# EAGLE design DB3AC_Fldigi_Baofeng_V02 (EAGLE 6.6.0)
Assembly variants: TRxA, RxA, TRxB, RxA, TRxA, RxB, TRxB, RxB
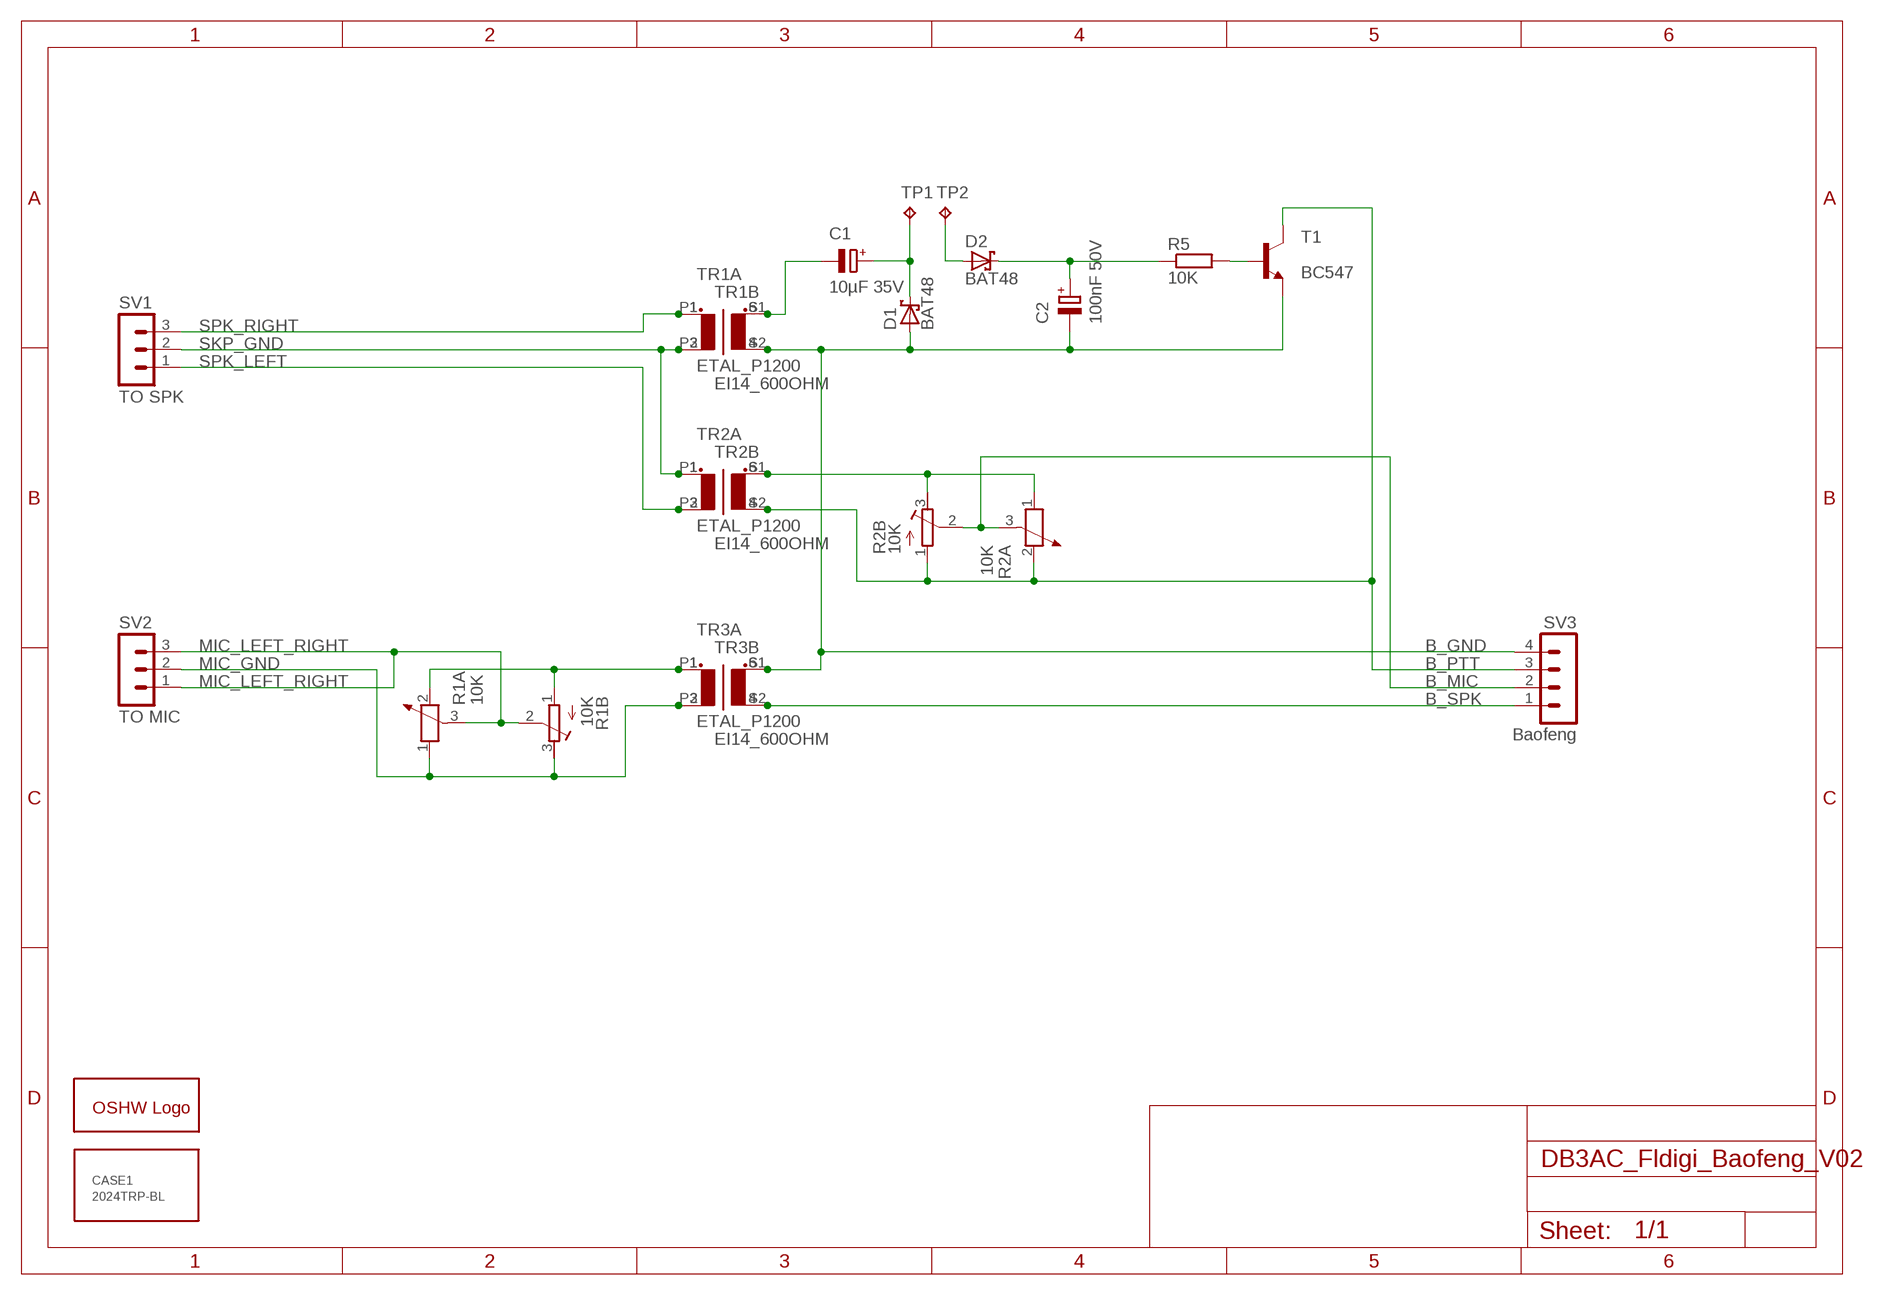
[diagram p0: schematic, sheet 1]

## Parts
C1  10µF 35V  CPOL-EUE2.5-7  [E2,5-7]
C2  100nF 50V  CPOL-EUE2.5-7  [E2,5-7]
CASE1  2024TRP-BL  [2024]
D1  BAT48  BAT42  [DO35-10]
D2  BAT48  BAT42  [DO35-10]
GOLD_ORB_SM1  OSHWLOGOLOGO8MM  [OSHW_8MM]
R1A  10K  POTENTIOMETER_PT-10  [PT-10]  (not fitted in variant TRxA, RxB)  (not fitted in variant TRxB, RxB)
R1B  10K  R-TRIMM3339P  [RTRIM3339P]  (not fitted in variant TRxA, RxA)  (not fitted in variant TRxB, RxA)
R2A  10K  POTENTIOMETER_PT-10  [PT-10]  (not fitted in variant TRxA, RxB)  (not fitted in variant TRxB, RxB)
R2B  10K  R-TRIMM3339P  [RTRIM3339P]  (not fitted in variant TRxA, RxA)  (not fitted in variant TRxB, RxA)
R5  10K  R-EU_0204/7  [0204/7]
SV1  TO SPK  MA03-1  [MA03-1]
SV2  TO MIC  MA03-1  [MA03-1]
SV3  Baofeng  MA04-1  [MA04-1]
T1  BC547  BC547-NPN-TO92-CBE  [TO92-CBE]
TP1  TPPAD1-13Y  [P1-13Y]
TP2  TPPAD1-13Y  [P1-13Y]
TR1A  ETAL_P1200  [ETAL_P1200]  (not fitted in variant TRxB, RxA)  (not fitted in variant TRxB, RxB)
TR1B  EI14_600OHM  [EI14]  (not fitted in variant TRxA, RxA)  (not fitted in variant TRxA, RxB)
TR2A  ETAL_P1200  [ETAL_P1200]  (not fitted in variant TRxB, RxA)  (not fitted in variant TRxB, RxB)
TR2B  EI14_600OHM  [EI14]  (not fitted in variant TRxA, RxA)  (not fitted in variant TRxA, RxB)
TR3A  ETAL_P1200  [ETAL_P1200]  (not fitted in variant TRxB, RxA)  (not fitted in variant TRxB, RxB)
TR3B  EI14_600OHM  [EI14]  (not fitted in variant TRxA, RxA)  (not fitted in variant TRxA, RxB)

## Nets
B_GND: C2.- D1.A SV3.4 T1.E TR1A.4(S2) TR1B.S2 TR3A.6(S1) TR3B.S1
B_MIC: R2A.3 R2B.2(S) SV3.2
B_PTT: R2A.2 R2B.1(A) SV3.3 T1.C TR2A.4(S2) TR2B.S2
B_SPK: SV3.1 TR3A.4(S2) TR3B.S2
MIC_GND: R1A.1 R1B.3(E) SV2.2 TR3A.3(P2) TR3B.P2
MIC_LEFT_RIGHT: R1A.3 R1B.2(S) SV2.1 SV2.3
N$1: R1A.2 R1B.1(A) TR3A.1 TR3B.P1
N$2: D2.A TP2.TP
N$6: R2A.1 R2B.3(E) TR2A.6(S1) TR2B.S1
N$8: C1.- TR1A.6(S1) TR1B.S1
N$11: R5.2 T1.B
N$12: C1.+ D1.C TP1.TP
N$13: C2.+ D2.C R5.1
SKP_GND: SV1.2 TR1A.3(P2) TR1B.P2 TR2A.1 TR2B.P1
SPK_LEFT: SV1.1 TR2A.3(P2) TR2B.P2
SPK_RIGHT: SV1.3 TR1A.1 TR1B.P1

## Library data of the parts
C1 C2 = rcl:CPOL-EU: POLARIZED CAPACITOR, European symbol
CASE1 = CaseStrapubox:2024: Link: http://strapubox.de/modules/uploadmanager11/admin/index.php?action=file_download&file_id=156&location_id=0; OC_CONRAD: 525967; OC_SEGOR: 2024 trp-bl
D1 D2 = diode:BAT42: DIODE barrier diode
GOLD_ORB_SM1 = oshw:OSHWLOGO: The OSHW logo for PCB layout
R1A R2A = rcl:POTENTIOMETER_: Potentiometer
R1B R2B = rcl:R-TRIMM: Trimm resistor
R5 = rcl:R-EU_: RESISTOR, European symbol
SV1 SV2 = con-lstb:MA03-1: PIN HEADER; OC_FARNELL: unknown; OC_NEWARK: unknown
SV3 = con-lstb:MA04-1: PIN HEADER; OC_FARNELL: unknown; OC_NEWARK: unknown
T1 = transistor:*-NPN-: NPN Transistror BF959 corrected 2008.03.06
TP1 TP2 = testpad:TP: Test pad
TR1A TR2A TR3A = TransformerAudio:ETAL_P1200: P1200 - Trenntransformator, Anpassungsübertrager, 100 µA The P1200 from ETAL is a line matching transformer. It is specifically designed to be easily matched to both 600 ohm and complex impedance telephone lines. This transformer is ideal for voice telecommunications applications and for data communications to V.32bis (14,400 bits/second), V.34 applications to 28,800bits/second data rates. - Insertion loss is 1.5dB - Return loss is 18dB - 12.6mm (0.5") seated height - Vacuum encapsulated - IEC 60950 and UL 60950 certified - UL recognized component; HERSTELLER: ETAL; MPN: P1200; OC_FARNELL: 1130832
TR1B TR2B TR3B = TransformerAudio:EI14_600OHM: Audio Transformer 600:600 Ohm 1:1 EI14 Kupplung Isolation Transformator - Modell: EI14 - Material: Nickel-Legierung - AC-Impedanz: EI14 600: 600 Ohm - Artikel: Audio-Transformator - Induktivität: 290mH (±20 %) - DC-Widerstand: 135(±%) - Aufwickelfähigkeit: Double-Draht wicklung - Qualität & Draht-Durchmesser: QS-1 0,06 MM - Primärspulen: 800 Umdrehungen - Sekundären Spulen: 800 Umdrehungen - Abwechseln-Strom Impedanzwert: 600

## Board
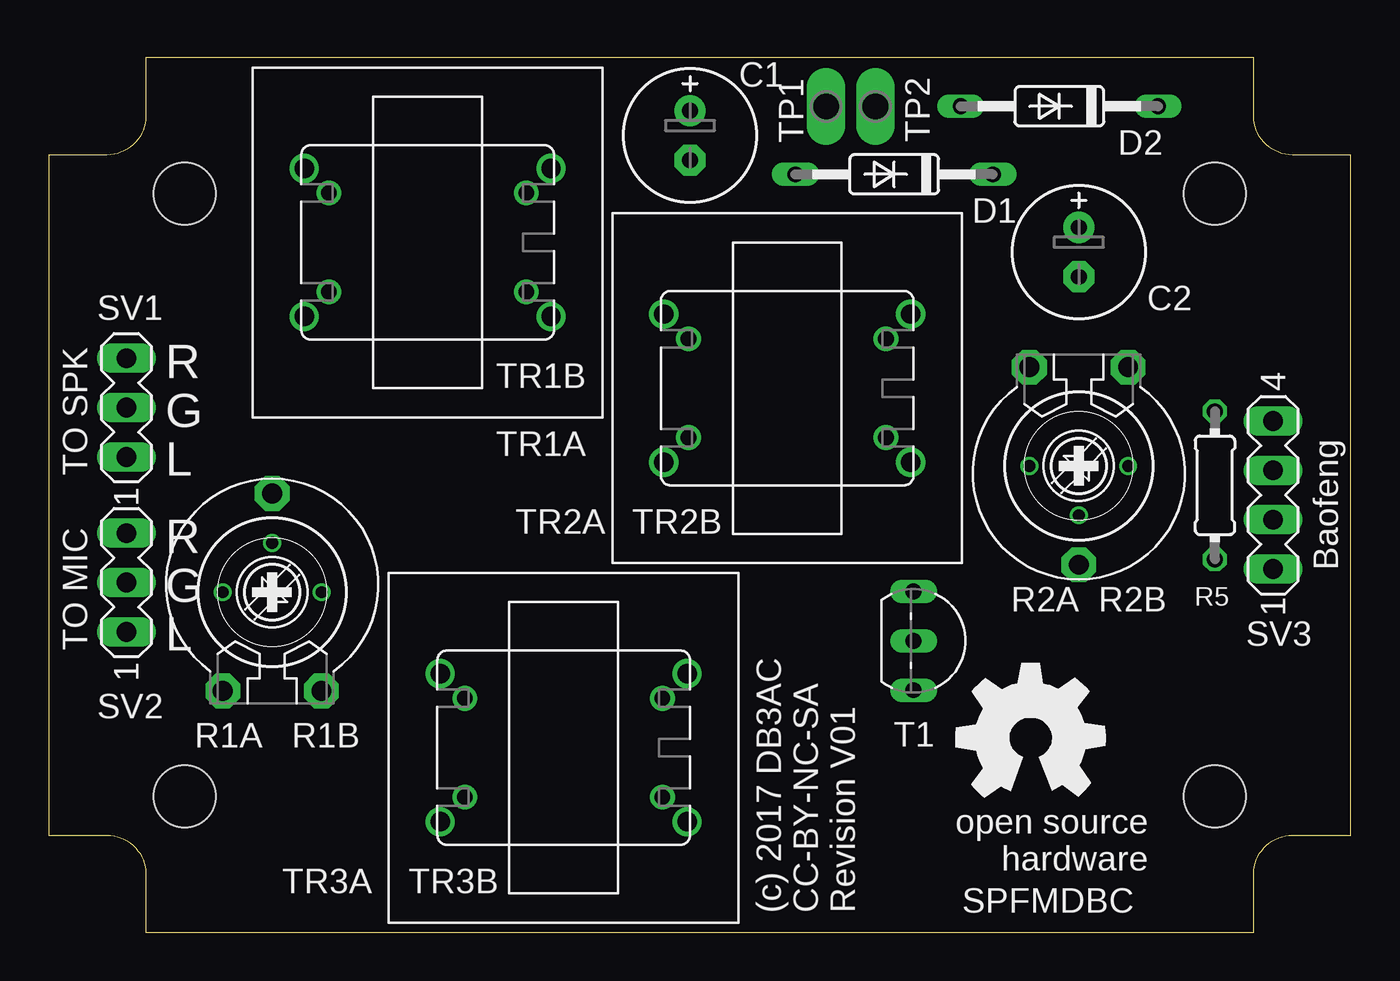
[diagram p1: board, top side]
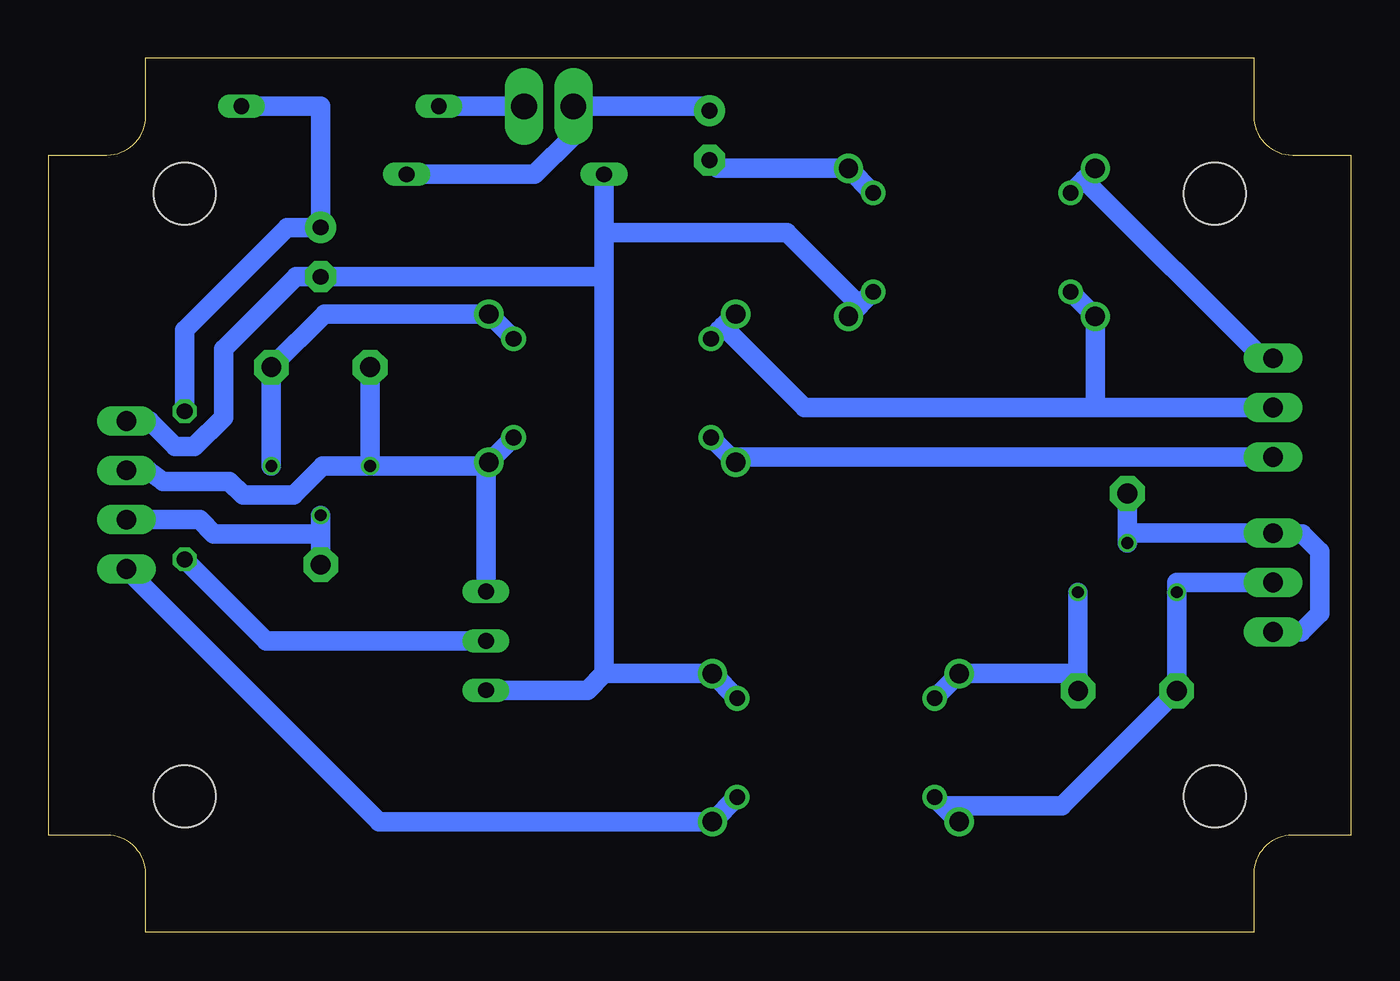
[diagram p2: board, bottom side, seen from below]

Size 67 x 45 mm. Coordinates in mm from the lower left corner, seen from the top.
Copper layers (1*16): Top 0.035mm / dielectric 1.5mm / Bottom 0.035mm
Design rules "default *": minimum track width 10mil, minimum drill 24mil, track to track 8mil, track to pad 8mil, pad to pad 8mil, via to via 8mil, smd to smd 8mil, copper to edge 40mil, drill to drill 8mil, minimum pad ring 1mil, minimum via ring 8mil, stop-mask expansion 4mil, vias tented up to drill 0mil, thermal gap 10mil
Holes 3.2 mm at 7,7 7,38 60,38 60,7
tKeepout: area 4,35 to 10,41; area 4,4 to 10,10; area 57,35 to 63,41; area 57,4 to 63,10
bKeepout: area 4,4 to 10,10; area 4,35 to 10,41; area 57,35 to 63,41; area 57,4 to 63,10

### Footprints (pad centres in the part's own frame; a part is rotated, then mirrored left to right if it is on the bottom)
E2,5-7 = drill 0.813 pad 1.6: + -1.27,0 | drill 0.813 pad 1.6 octagon: - 1.27,0
DO35-10 = drill 0.813 long: A 5.08,0; C -5.08,0
PT-10 = drill 1.016 pad 1.778 octagon: 1 -2.54,-5.08; 2 2.54,-5.08; 3 0,5.08
RTRIM3339P = drill 0.61: 1 -2.54,0; 2 0,-2.54; 3 2.54,0
0204/7 = drill 0.813 octagon: 1 -3.81,0; 2 3.81,0
MA03-1 = drill 1.016 long: 1 -2.54,0; 2 0,0; 3 2.54,0
MA04-1 = drill 1.016 long: 1 -3.81,0; 2 -1.27,0; 3 1.27,0; 4 3.81,0
TO92-CBE = drill 0.813 long: B 0,0; C -2.54,0; E 2.54,0
P1-13Y = drill 1.321 pad 1.905 long: TP 0,0
ETAL_P1200 = drill 1 pad 1.27: 1 -6.35,3.81; 3 -6.35,-3.81; 4 6.35,-3.81; 6 6.35,3.81
EI14 = drill 0.8 pad 1.27: P1 -5.08,2.54; P2 -5.08,-2.54; S1 5.08,2.54; S2 5.08,-2.54

### Placement (x,y rotation side)
C1  33,41 270 top
C2  53,35 270 top
CASE1  0,0 0 top
D1  43.5,39 180 top
D2  52,42.5 180 top
GOLD_ORB_SM1  50.5,10 0 top
R1A  11.5,17.5 0 top
R1B  11.5,17.5 180 top
R2A  53,24 180 top
R2B  53,24 0 top
R5  60,23 270 top
SV1  4,27 90 top
SV2  4,18 90 top
SV3  63,22.5 90 top
T1  44.5,15 270 top
TP1  40,42.5 0 top
TP2  42.54,42.5 0 top
TR1A  19.5,35.5 0 top
TR1B  19.5,35.5 0 top
TR2A  38,28 0 top
TR2B  38,28 0 top
TR3A  26.5,9.5 0 top
TR3B  26.5,9.5 0 top

### Tracks (layer width: path | path; a pad name or v marks a point on that pad's centre or on a via)
B_GND
  Bottom 1: TR1B.S2 TR1A.4 25.3,32.3 29,36 38.42,36 D1.A | TR3B.S1 TR3A.6 38.42,13.31 | D1.A 38.42,13.31 | T1.E 39.27,12.46 38.42,13.31 | SV3.4 61.81,26.31 60.5,25 59.5,25 58,26.5 58,30 54.27,33.73 C2.- 38.42,33.73 D1.A
B_MIC
  Bottom 1: R2A.3 53,20.5 | 53,20.5 R2B.2 53,21.23 | SV3.2 59.23,21.23 58.5,20.5 53,20.5
B_PTT
  Bottom 1: TR2A.4 TR2B.S2 | R2B.1 R2A.2 | TR2A.4 44.54,24 R2B.1 | R2B.1 52.9,24 54.4,22.5 57,22.5 57.7,23.2 61.1,23.2 61.87,23.77 SV3.3 | T1.C 44.5,24.04 TR2A.4
B_SPK
  Bottom 1: TR3B.S2 TR3A.4 50,5.69 SV3.1
MIC_GND
  Bottom 1: TR3B.P2 20.98,6.52 | 20.98,6.52 TR3A.3 | SV2.2 8.96,18 R1B.3 R1A.1 14.86,6.52 20.98,6.52
MIC_LEFT_RIGHT
  Bottom 1: R1A.3 R1B.2 11.5,20.54 SV2.3 3.96,20.5 2.5,20.5 1.6,19.6 1.6,16.4 2.54,15.46 SV2.1
N$1
  Bottom 1: R1B.1 14.04,14 14.04,13.31 | 14.04,13.31 R1A.2 | TR3B.P1 TR3A.1 14.04,13.31
N$2
  Bottom 1: TP2.TP D2.A
N$6
  Bottom 1: TR2B.S1 TR2A.6 52.81,31.81 R2A.1 R2B.3
N$8
  Bottom 1: TR1B.S1 TR1A.6 32.58,39.31 C1.-
N$11
  Bottom 1: T1.B 55.81,15 R5.2
N$12
  Bottom 1: 33.23,42.5 C1.+ 33,42.5 TP1.TP 40,41 42,39 D1.C
N$13
  Bottom 1: R5.1 60,31 54.73,36.27 C2.+ 53,42.5 D2.C
SKP_GND
  Bottom 1: TR1B.P2 TR1A.3 13.15,27 | 8.46,27 SV1.2 12,27 13.15,27 | TR2B.P1 TR2A.1 31.69,31.81 32.3,31.2 | 32.5,31 32.3,31.2 | 32.3,31.2 28.1,27 13.15,27
SPK_LEFT
  Bottom 1: TR2A.3 TR2B.P2 31.92,24.46 SV1.1
SPK_RIGHT
  Bottom 1: TR1A.1 13.73,38.73 | 13.73,38.73 TR1B.P1 | SV1.3 4.54,29.54 13.73,38.73

### Text on the board
tNames: R | G | L | R | G | L | (c) 2017 DB3AC / CC-BY-NC-SA / Revision V01 | SPFMDBC